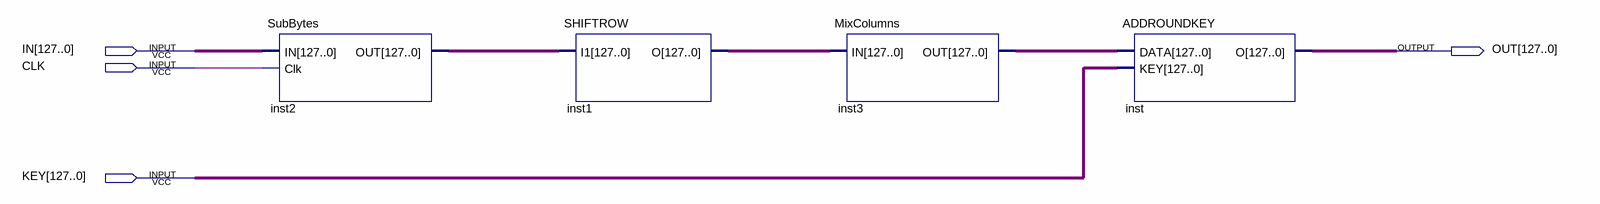
[diagram p0: schematic sheet]
// Quartus schematic ROUND.bdf as structural Verilog: 4 symbols, 4 pins
module ROUND (
  input  [127:0] IN,
  input  CLK,
  input  [127:0] KEY,
  output [127:0] OUT
);

  wire [127:0] inst1_o, inst2_out, inst3_out;

  SubBytes inst2 (.IN(IN), .Clk(CLK), .OUT(inst2_out));
  SHIFTROW inst1 (.I1(inst2_out), .O(inst1_o));
  MixColumns inst3 (.IN(inst1_o), .OUT(inst3_out));
  ADDROUNDKEY inst (.DATA(inst3_out), .KEY(KEY), .O(OUT));
endmodule
